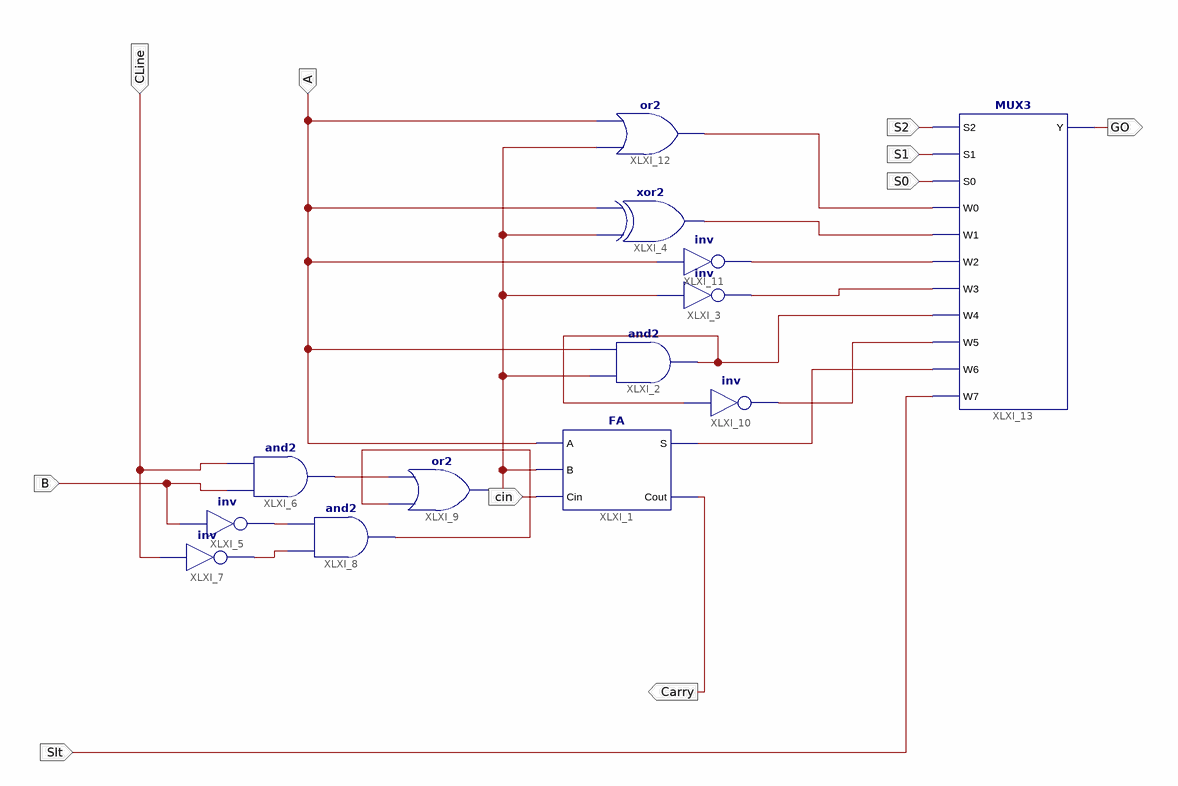
[diagram p0: schematic sheet 1]
// Xilinx ISE schematic ALU.sch (spartan3a) as structural Verilog: 13 symbols, 10 ports
module ALU (
  input  A,
  input  CLine,
  input  B,
  input  Slt,
  input  S2,
  input  S1,
  input  S0,
  input  cin,
  output Carry,
  output GO
);

  wire XLXN_10, XLXN_11, XLXN_12, XLXN_15, XLXN_22, XLXN_25, XLXN_26, XLXN_27, XLXN_28, XLXN_29, XLXN_30,
       XLXN_31;

  FA XLXI_1 (.A(A), .B(XLXN_22), .Cin(cin), .S(XLXN_31), .Cout(Carry));
  and XLXI_2 (XLXN_29, XLXN_22, A);
  not XLXI_3 (XLXN_28, XLXN_22);
  xor XLXI_4 (XLXN_26, XLXN_22, A);
  not XLXI_5 (XLXN_10, B);
  and XLXI_6 (XLXN_12, B, CLine);
  not XLXI_7 (XLXN_11, CLine);
  and XLXI_8 (XLXN_15, XLXN_11, XLXN_10);
  or XLXI_9 (XLXN_22, XLXN_15, XLXN_12);
  not XLXI_10 (XLXN_30, XLXN_29);
  not XLXI_11 (XLXN_27, A);
  or XLXI_12 (XLXN_25, XLXN_22, A);
  MUX3 XLXI_13 (
    .S2(S2), .S1(S1), .S0(S0), .W0(XLXN_25), .W1(XLXN_26), .W2(XLXN_27), .W3(XLXN_28), .W4(XLXN_29),
    .W5(XLXN_30), .W6(XLXN_31), .W7(Slt), .Y(GO));
endmodule
